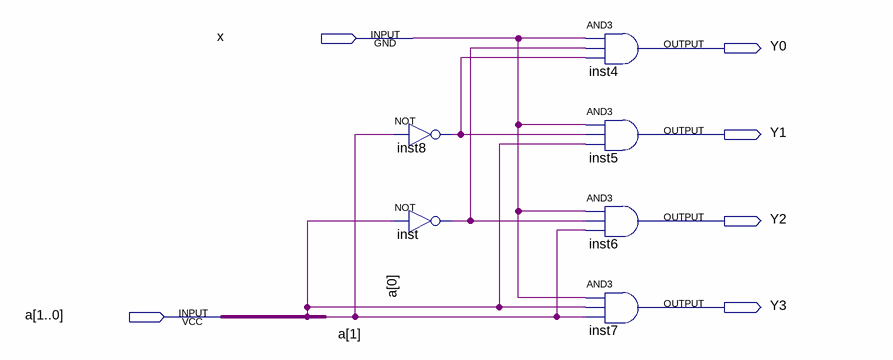
[diagram p0: schematic sheet]
// Quartus schematic demultiplexer.bdf as structural Verilog: 6 symbols, 6 pins
module demultiplexer (
  input  x,
  input  [1:0] a,
  output Y0,
  output Y1,
  output Y2,
  output Y3
);

  wire inst8_out, inst_out;

  not inst8 (inst8_out, a[1]);
  not inst (inst_out, a[0]);
  and inst4 (Y0, x, inst_out, inst8_out);
  and inst5 (Y1, x, inst8_out, a[0]);
  and inst6 (Y2, x, inst_out, a[1]);
  and inst7 (Y3, x, a[0], a[1]);
endmodule
